# Altium schematic sheet 电机驱动.SchDoc
size A4
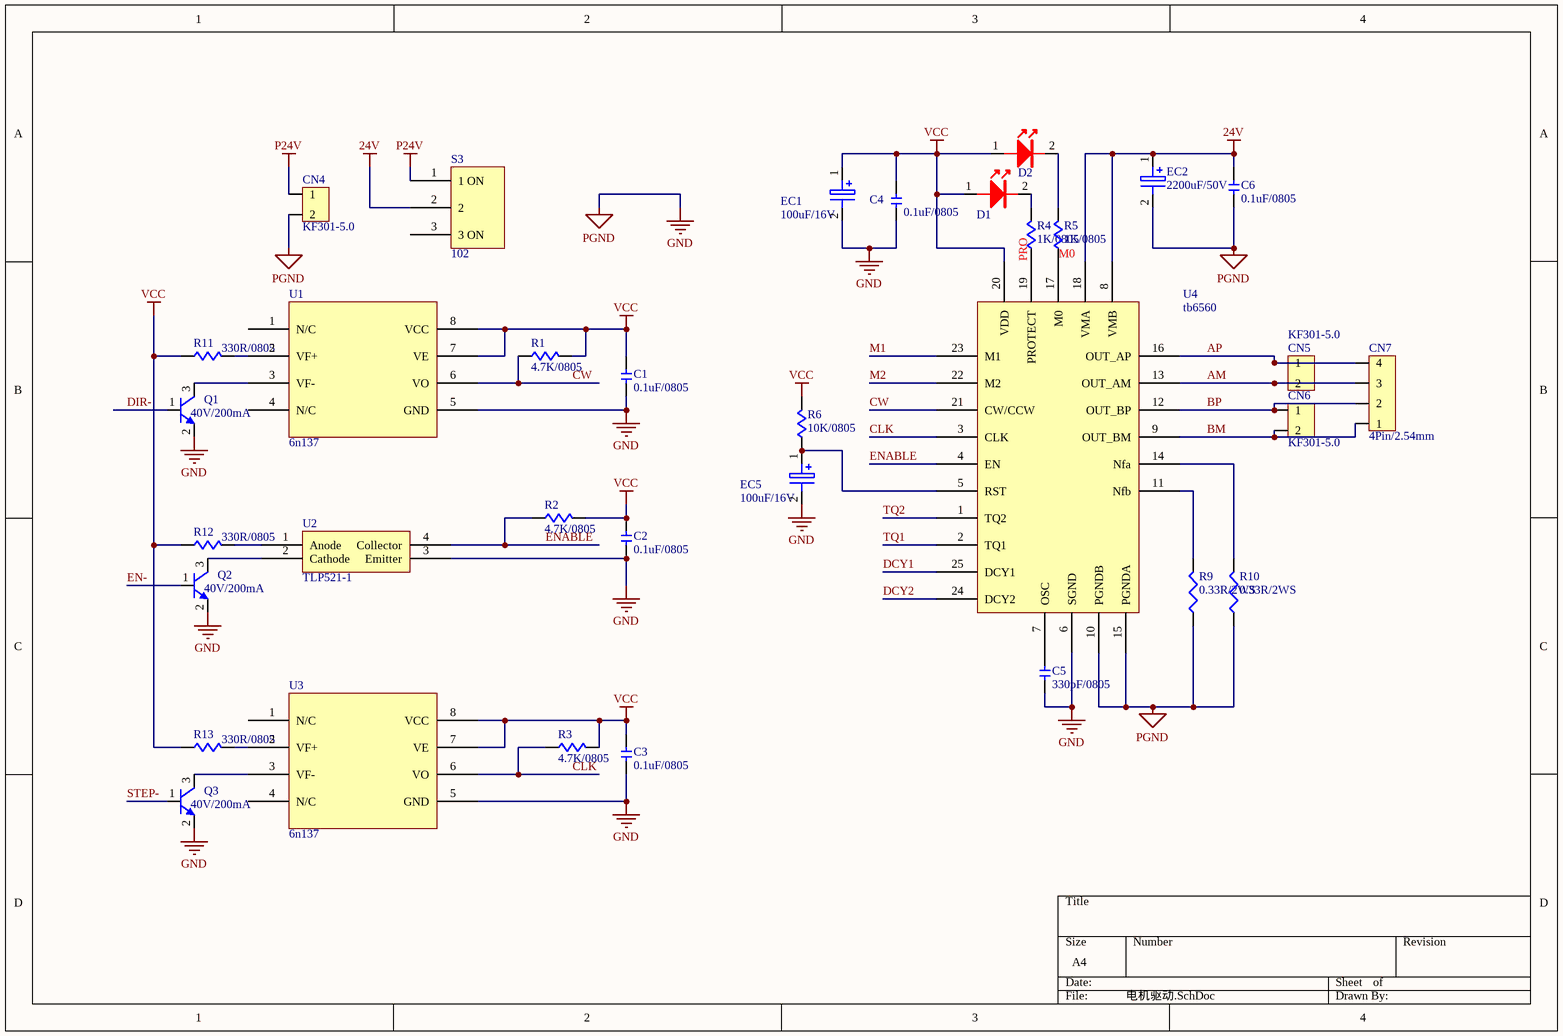
[diagram p0: 电机驱动.SchDoc]

## Parts
C1  0.1uF/0805  [WSC0805]
C2  0.1uF/0805  [WSC0805]
C3  0.1uF/0805  [WSC0805]
C4  0.1uF/0805  [WSC0805]
C5  330pF/0805  [WSC0805]
C6  0.1uF/0805  [WSC0805]
CN4  KF301-5.0  [KF301-5.0]
CN5  KF301-5.0  [KF301-5.0]
CN6  KF301-5.0  [KF301-5.0]
CN7  4Pin/2.54mm  [THT-CON4-2.54-2.54A/S-H8.5]
D1  LED0805  [SD0805]  (value not drawn)
D2  LED0805  [SD0805]  (value not drawn)
EC1  100uF/16V  [CAPC2-5-5*11A/D]
EC2  2200uF/50V  [CAPC2-7.5-18*35.5A/S]
EC5  100uF/16V  [CAPC2-5-5*11A/D]
Q1  40V/200mA  [WSOT-23]
Q2  40V/200mA  [WSOT-23]
Q3  40V/200mA  [WSOT-23]
R1  4.7K/0805  [WSR0805]
R2  4.7K/0805  [WSR0805]
R3  4.7K/0805  [WSR0805]
R4  1K/0805  [WSR0805]
R5  1K/0805  [WSR0805]
R6  10K/0805  [WSR0805]
R9  0.33R/2WS  [R2-7.5-4.5A/S]
R10  0.33R/2WS  [R2-7.5-4.5A/S]
R11  330R/0805  [WSR0805]
R12  330R/0805  [WSR0805]
R13  330R/0805  [WSR0805]
S3  102  [开关]
U1  6n137  [6N137]
U2  TLP521-1  [tlp521 - duplicate]
U3  6n137  [6N137]
U4  tb6560  [TB6560]

## Nets
24V: C6.2 EC2.1 S3.2 U4.8(VMB) U4.18(VMA)
GND: C1.1 C2.1 C3.1 C4.1 C5.1 C6.1 CN4.2 EC1.2 EC2.2 EC5.2 Q1.2(E) Q2.2(E) Q3.2(E) R9.1 R10.1 U1.5(GND) U2.3(Emitter) U3.5(GND) U4.6(SGND) U4.10(PGNDB) U4.15(PGNDA)  [also labelled PGND]
P24V: CN4.1 S3.1(1_ON)
VCC: C1.2 C2.2 C3.2 C4.2 D1.1(A) D2.1(A) EC1.1 R1.2 R2.2 R3.2 R6.2 R11.1 R12.1 R13.1 U1.7(VE) U1.8(VCC) U3.7(VE) U3.8(VCC) U4.20(VDD)
AM: CN5.2 CN7.3 U4.13(OUT_AM)
AP: CN5.1 CN7.4 U4.16(OUT_AP)
BM: CN6.2 CN7.1 U4.9(OUT_BM)
BP: CN6.1 CN7.2 U4.12(OUT_BP)
CLK: R3.1 U3.6(VO) U4.3(CLK)
CW: R1.1 U1.6(VO) U4.21(CW/CCW)
DCY1: U4.25(DCY1)
DCY2: U4.24(DCY2)
DIR-: Q1.1(B)
EN-: Q2.1(B)
ENABLE: R2.1 U2.4(Collector) U4.4(EN)
M0: R5.1 U4.17(M0)
M1: U4.23(M1)
M2: U4.22(M2)
PRO: R4.1 U4.19(PROTECT)
STEP-: Q3.1(B)
TQ1: U4.2(TQ1)
TQ2: U4.1(TQ2)
NetC5_2: C5.2 U4.7(OSC)
NetD1_2: D1.2(K) R4.2
NetD2_2: D2.2(K) R5.2
NetEC5_1: EC5.1 R6.1 U4.5(RST)
NetQ1_3: Q1.3(C) U1.3(VF-)
NetQ2_3: Q2.3(C) U2.2(Cathode)
NetQ3_3: Q3.3(C) U3.3(VF-)
NetR9_2: R9.2 U4.11(Nfb)
NetR10_2: R10.2 U4.14(Nfa)
NetR11_2: R11.2 U1.2(VF+)
NetR12_2: R12.2 U2.1(Anode)
NetR13_2: R13.2 U3.2(VF+)

Not connected (* = marked no-connect by the designer): S3 3(3_ON); U1 1(N/C) 4(N/C); U3 1(N/C) 4(N/C)

## Library data of the parts
C1-C4 = R21050165: R21050165/工业C/消费C/贴片电容/0.1uF/±10%/50V/X7R/0805; 装配类型: SMD; 物料编码: R21050165; 物料描述: 贴片电容/0.1uF/±10%/50V/X7R/0805; 优选等级: 工业C/消费C
C5 = R21180028: R21180028/消费C/台系贴片电容/330pF/±10%/50V/X7R/0805; 优选等级: 消费C; 装配类型: SMD; 物料编码: R21180028; 物料描述: 台系贴片电容/330pF/±10%/50V/X7R/0805
C6 = R21050005: R21050005/工业B/消费B/贴片电容/0.1uF±10%/50V/X7R/0805; 装配类型: SMD; 物料编码: R21050005; 物料描述: 贴片电容/0.1uF±10%/50V/X7R/0805; 优选等级: 工业B/消费B
CN7 = R30041122: R30041122/消费B/普通插座/单排排母/4PIN/3A/单排/直脚/鱼叉母座/2.54mm/-40~105℃/H=8.5mm; 优选等级: 消费B; 装配类型: THT; 物料描述: 普通插座/单排排母/4PIN/3A/单排/直脚/鱼叉母座/2.54mm/-40~105℃/H=8.5mm; 物料编码: R30041122
D1 D2 = R26010108: R26010108/工业A/消费A/发光二极管/红色/61mcd@20mA/0805SMD/LED0805; 装配类型: SMD; 物料描述: 发光二极管/红色/61mcd@20mA/0805SMD; 物料编码: R26010108; 优选等级: 工业A/消费A
EC1 EC5 = R21010764: R21010764/消费C/铝电解电容/105℃/100uF/16V/φ5*11; 优选等级: 消费C; 装配类型: THT; 物料编码: R21010764; 物料描述: 铝电解电容/105℃/100uF/16V/φ5*11
EC2 = R21110099: R21110099/工业B/铝电解电容/105℃/2200uF/50V/低阻/φ18*35.5/7000h; 优选等级: 工业B; 装配类型: THT; 物料编码: R21110099; 物料描述: 铝电解电容/105℃/2200uF/50V/低阻/φ18*35.5/7000h
Q1-Q3 = R26080001: R26080001/工业A/消费A/小信号三极管/NPN/40V/200mA/SOT-23; 装配类型: SMD; 物料编码: R26080001; 物料描述: 小信号三极管/NPN/40V/200mA/SOT-23; 优选等级: 工业A/消费A
R1-R3 = R20180039: R20180039/工业A/消费A/贴片电阻/1/8W/4.7KΩ±5%/0805; 装配类型: SMD; 物料编码: R20180039; 物料描述: 贴片电阻/1/8W/4.7KΩ±5%/0805; 优选等级: 工业A/消费A
R4 R5 = R20180023: R20180023/工业A/消费A/贴片电阻/1/8W/1KΩ±5%/0805; 装配类型: SMD; 物料编码: R20180023; 物料描述: 贴片电阻/1/8W/1KΩ±5%/0805; 优选等级: 工业A/消费A
R6 = R20180048: R20180048/工业A/消费A/贴片电阻/1/8W/10KΩ±5%/0805; 装配类型: SMD; 物料编码: R20180048; 物料描述: 贴片电阻/1/8W/10KΩ±5%/0805; 优选等级: 工业A/消费A
R9 R10 = R20040079: R20040079/工业B/消费B/无感线绕电阻/2WS/0.33Ω±5%/小型4.5*11; 装配类型: THT; 优选等级: 工业B/消费B; 物料描述: 无感线绕电阻/2WS/0.33Ω±5%/小型4.5*11; 物料编码: R20040079
R11-R13 = R20180090: R20180090/工业A/消费A/贴片电阻/1/8W/330Ω±5%/0805; 装配类型: SMD; 物料编码: R20180090; 物料描述: 贴片电阻/1/8W/330Ω±5%/0805; 优选等级: 工业A/消费A
S3 = switch mts102
U1 U3 = 6n137: 6n137高速度光耦
U2 = TLP521: TLP521-1/光耦
U4 = tb6560: tb6560、步进电机驱动